# EAGLE design AutoIrrigator_Schematic (EAGLE 9.6.2)
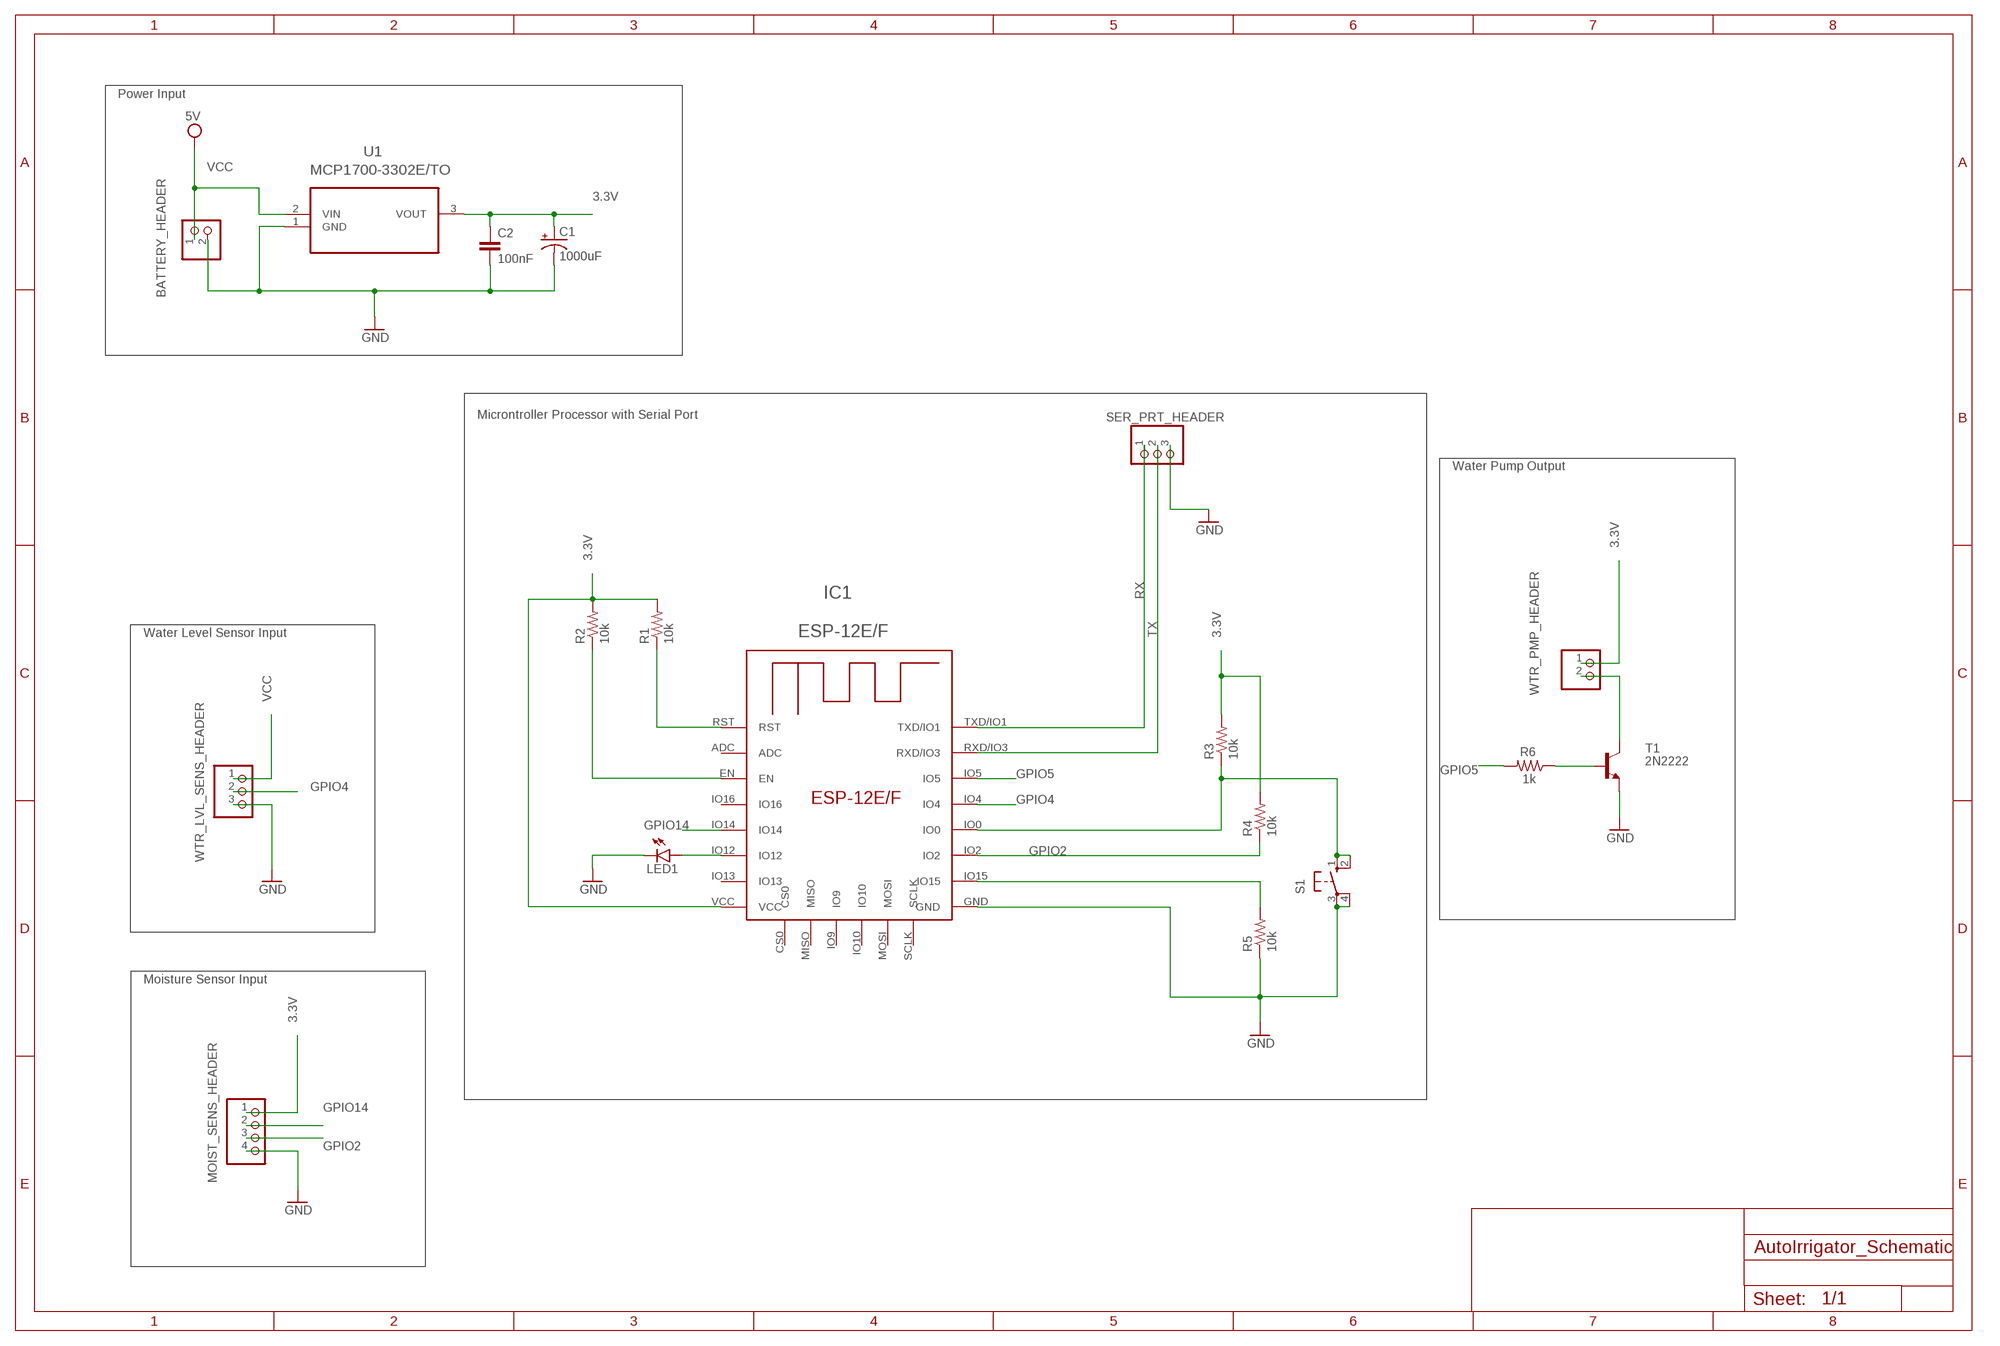
[diagram p0: schematic, sheet 1]

## Parts
BATTERY_HEADER  PINHD-1X2  [1X02]
C1  1000uF  CPOL-USE2.5-6  [E2,5-6]
C2  100nF  C-EU025-025X050  [C025-025X050]
IC1  ESP-12E/F  [ESP-12E]
LED1  LED5MM  [LED5MM]
MOIST_SENS_HEADER  PINHD-1X4  [1X04]
R1  10k  R-US_0204/7  [0204/7]
R2  10k  R-US_0204/7  [0204/7]
R3  10k  R-US_0204/7  [0204/7]
R4  10k  R-US_0204/7  [0204/7]
R5  10k  R-US_0204/7  [0204/7]
R6  1k  R-US_0204/7  [0204/7]
S1  10-XX  [B3F-10XX]
SER_PRT_HEADER  SER_PRT_HEADER  PINHD-1X3  [1X03]
T1  2N2222  [TO18]
U1  MCP1700-3302E/TO  [TO127P254X495-3]
WTR_LVL_SENS_HEADER  PINHD-1X3  [1X03]
WTR_PMP_HEADER  PINHD-1X2  [1X02]

## Nets
3.3V [Power]: C1.+ C2.1 IC1.VCC MOIST_SENS_HEADER.1 R1.2 R2.2 R3.2 R4.2 U1.3(VOUT) WTR_PMP_HEADER.1
COLLECTOR: T1.3(C) WTR_PMP_HEADER.2
EMITTER: R6.1 T1.2(B)
EN: IC1.EN R2.1
GND [Power]: BATTERY_HEADER.2 C1.- C2.2 IC1.GND LED1.K(C) MOIST_SENS_HEADER.4 R5.1 S1.3(P) S1.4(P1) SER_PRT_HEADER.3 T1.1(E) U1.1(GND) WTR_LVL_SENS_HEADER.3
GPIO0: IC1.IO0 R3.1 S1.1(S) S1.2(S1)
GPIO2: IC1.IO2 MOIST_SENS_HEADER.3 R4.1
GPIO4: IC1.IO4 WTR_LVL_SENS_HEADER.2
GPIO5: IC1.IO5 R6.2
GPIO12: IC1.IO12 LED1.A
GPIO14: IC1.IO14 MOIST_SENS_HEADER.2
GPIO15: IC1.IO15 R5.2
RST: IC1.RST R1.1
RX: IC1.TXD/IO1 SER_PRT_HEADER.1
TX: IC1.RXD/IO3 SER_PRT_HEADER.2
VCC [Power]: BATTERY_HEADER.1 U1.2(VIN) WTR_LVL_SENS_HEADER.1 ; supply symbol labelled 5V
Unconnected: IC1.ADC IC1.CS0 IC1.IO9 IC1.IO10 IC1.IO13 IC1.IO16 IC1.MISO IC1.MOSI IC1.SCLK

## Notes on the sheet
- Power Input
- Microntroller Processor with Serial Port
- Water Pump Output
- Water Level Sensor Input
- Moisture Sensor Input

## Library data of the parts
BATTERY_HEADER WTR_PMP_HEADER = pinhead:PINHD-1X2: PIN HEADER
C1 = rcl:CPOL-US: POLARIZED CAPACITOR, American symbol; SPICEPREFIX: C
C2 = rcl:C-EU: CAPACITOR, European symbol; SPICEPREFIX: C
IC1 = esp-12e-f:ESP-12E/F
LED1 = led:LED: LED OSRAM: - CHIPLED LG R971, LG N971, LY N971, LG Q971, LY Q971, LO R971, LY R971 LH N974, LH R974 LS Q976, LO Q976, LY Q976 LO Q996 - Hyper CHIPLED LW Q18S LB Q993, LB Q99A, LB R99A - SideLED LS A670, LO A670, LY A670, LG A670, LP A670 LB A673, LV A673, LT A673, LW A673 LH A674 LY A675 LS A676, LA A676, LO A676, LY A676, LW A676 LS A679, LY A679, LG A679 - Hyper Micro SIDELED® LS Y876, LA Y876, LO Y876, LY Y876 LT Y87S - SmartLED LW L88C, LW L88S LB L89C, LB L89S, LG L890 LS L89K, LO L89K, LY L89K LS L896, LA L896, LO L896, LY L896 - TOPLED LS T670, LO T670, LY T670, LG T670, LP T670 LSG T670, LSP T670, LSY T670, LOP T670, LYG T670 LG T671, LOG T671, LSG T671 LB T673, LV T673, LT T673, LW T673 LH T674 LS T676, LA T676, LO T676, LY T676, LB T676, LH T676, LSB T676, LW T676 LB T67C, LV T67C, LT T67C, LS T67K, LO T67K, LY T67K, LW E67C LS E67B, LA E67B, LO E67B, LY E67B, LB E67C, LV E67C, LT E67C LW T67C LS T679, LY T679, LG T679 LS T770, LO T770, LY T770, LG T770, LP T770 LB T773, LV T773, LT T773, LW T773 LH T774 LS E675, LA E675, LY E675, LS T675 LS T776, LA T776, LO T776, LY T776, LB T776 LHGB T686 LT T68C, LB T68C - Hyper Mini TOPLED® LB M676 - Mini TOPLED Santana® LG M470 LS M47K, LO M47K, LY M47K Source: http://www.osram.convergy.de LUXEON: - LUMILED® LXK2-PW12-R00, LXK2-PW12-S00, LXK2-PW14-U00, LXK2-PW14-V00 LXK2-PM12-R00, LXK2-PM12-S00, LXK2-PM14-U00 LXK2-PE12-Q00, LXK2-PE12-R00, LXK2-PE12-S00, LXK2-PE14-T00, LXK2-PE14-U00 LXK2-PB12-K00, LXK2-PB12-L00, LXK2-PB12-M00, LXK2-PB14-N00, LXK2-PB14-P00, LXK2-PB14-Q00 LXK2-PR12-L00, LXK2-PR12-M00, LXK2-PR14-Q00, LXK2-PR14-R00 LXK2-PD12-Q00, LXK2-PD12-R00, LXK2-PD12-S00 LXK2-PH12-R00, LXK2-PH12-S00 LXK2-PL12-P00, LXK2-PL12-Q00, LXK2-PL12-R00 Source: www.luxeon.com KINGBRIGHT: KA-3528ASYC Source: www.kingbright.com
MOIST_SENS_HEADER = pinhead:PINHD-1X4: PIN HEADER
R1-R6 = rcl:R-US_: RESISTOR, American symbol; SPICEPREFIX: R
S1 = switch-omron:10-XX: OMRON SWITCH; MPN: B3F-1000; OC_FARNELL: 176432; OC_NEWARK: 36M3542
SER_PRT_HEADER WTR_LVL_SENS_HEADER = pinhead:PINHD-1X3: PIN HEADER
T1 = transistor:2N2222: NPN TRANSISTOR
U1 = MCP1700-3302E_TO:MCP1700-3302E/TO: IC LDO REG 250MA 5.0V Check prices <https://pricing.snapeda.com/parts/MCP1700-3302E/TO/Microchip/view-part?ref=eda>; AVAILABILITY: Good; DESCRIPTION: Linear Voltage Regulator IC 1 Output 250mA TO-92-3; MF: Microchip; MP: MCP1700-3302E/TO; PACKAGE: TO-92 Microchip; PRICE: None; PURCHASE-URL: https://pricing.snapeda.com/search/part/MCP1700-3302E/TO/?ref=eda

## Net classes
0 default: width 0.254 mm, drill 0.152 mm, clearance 0.254 mm
1 Power: width 1.143 mm, drill 0.152 mm, clearance 0.254 mm

## Board
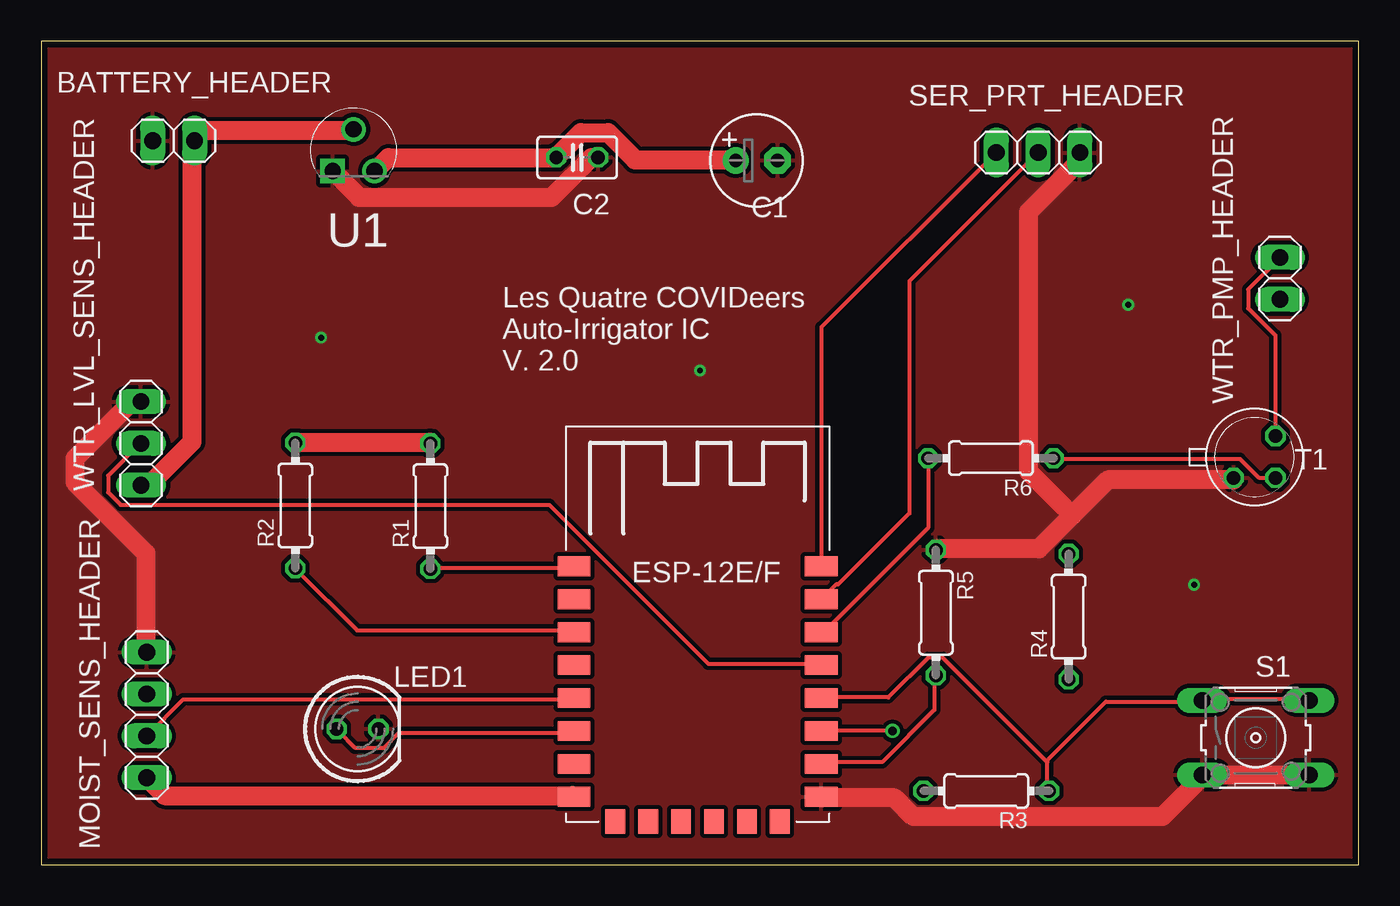
[diagram p1: board, top side]
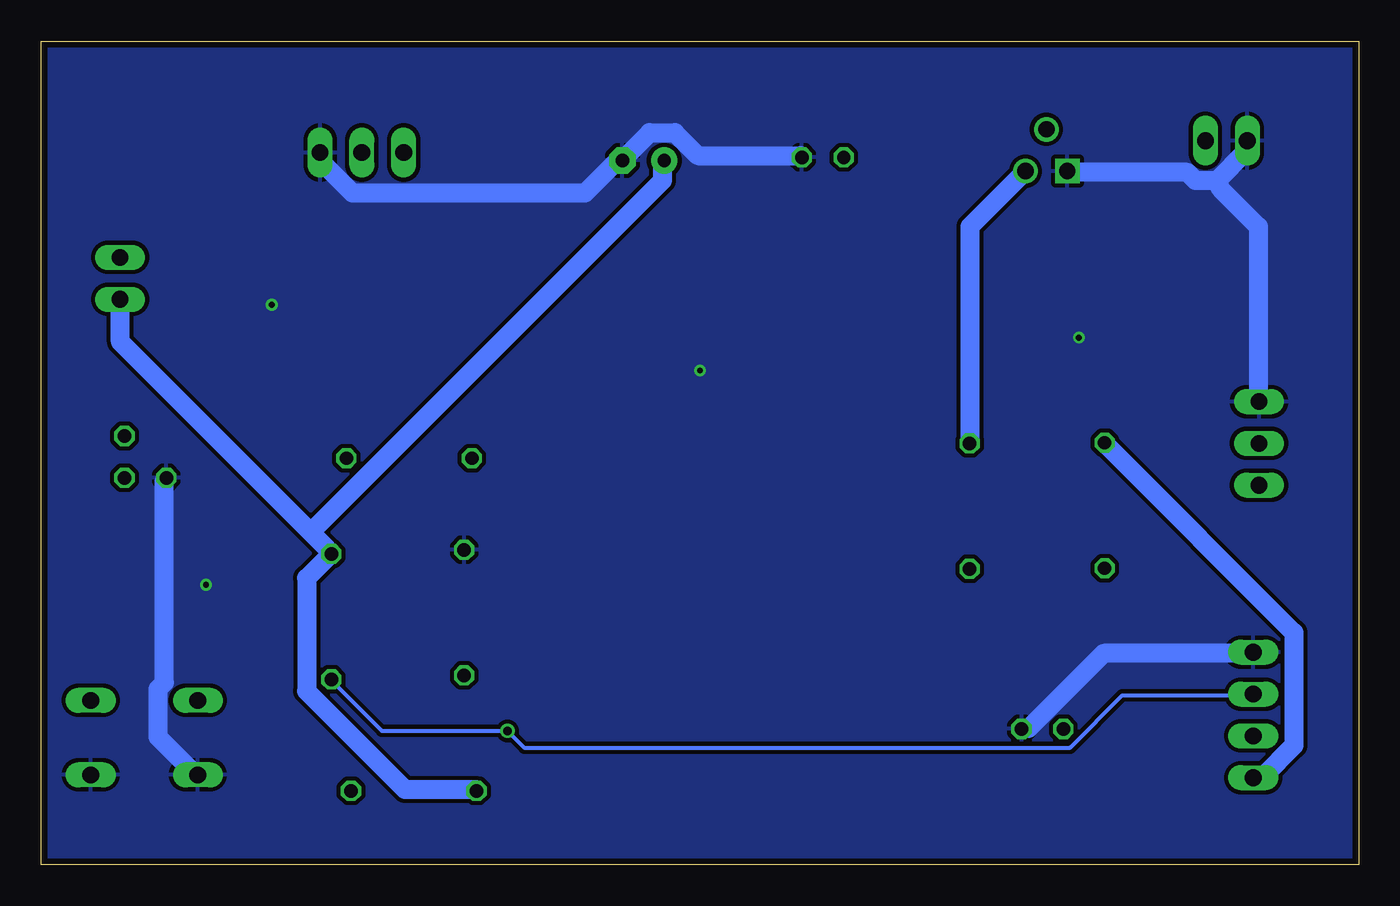
[diagram p2: board, bottom side, seen from below]

Size 80 x 50 mm. Coordinates in mm from the lower left corner, seen from the top.
Outline: 0,0 80,0 80,50 0,50 0,0
Copper layers (1*16): Top 0.0356mm / dielectric 1.5011mm / Bottom 0.0356mm
Design rules "LaenPCBOrder": minimum track width 6mil, minimum drill 13mil, track to track 6mil, track to pad 6mil, pad to pad 6mil, via to via 6mil, smd to smd 6mil, copper to edge 15mil, drill to drill 6mil, minimum pad ring 7mil, minimum via ring 7mil, stop-mask expansion 3mil, vias tented up to drill 0mil, thermal gap 10mil

### Footprints (pad centres in the part's own frame; a part is rotated, then mirrored left to right if it is on the bottom)
1X02 = drill 1.016 long: 1 -1.27,0; 2 1.27,0
E2,5-6 = drill 0.813 pad 1.6: + -1.27,0 | drill 0.813 pad 1.6 octagon: - 1.27,0
C025-025X050 = drill 0.813 octagon: 1 -1.27,0; 2 1.27,0
ESP-12E = smd 2 x 1.2: ADC -7.46,5.53; EN -7.46,3.53; GND 7.54,-6.47; IO0 7.54,-0.47; IO2 7.54,-2.47; IO4 7.54,1.53; IO5 7.54,3.53; IO12 -7.46,-2.47; IO13 -7.46,-4.47; IO14 -7.46,-0.47; IO15 7.54,-4.47; IO16 -7.46,1.53; RST -7.46,7.53; RXD/IO3 7.54,5.53; TXD/IO1 7.54,7.53; VCC -7.46,-6.47 | smd 1.2 x 1.5: CS0 -4.96,-7.97; IO9 -0.96,-7.97; IO10 1.04,-7.97; MISO -2.96,-7.97; MOSI 3.04,-7.97; SCLK 5.04,-7.97
LED5MM = drill 0.813 octagon: A -1.27,0; K 1.27,0
1X04 = drill 1.016 long: 1 -3.81,0; 2 -1.27,0; 3 1.27,0; 4 3.81,0
0204/7 = drill 0.813 octagon: 1 -3.81,0; 2 3.81,0
B3F-10XX = drill 1.016 long: 1 -3.251,2.261; 2 3.251,2.261; 3 -3.251,-2.261; 4 3.251,-2.261
1X03 = drill 1.016 long: 1 -2.54,0; 2 0,0; 3 2.54,0
TO18 = drill 0.813 octagon: 1 -1.27,-1.27; 2 1.27,-1.27; 3 1.27,1.27
TO127P254X495-3 = drill 0.991 square: 1 -2.54,-2.54 | drill 0.991: 2 -1.27,0; 3 0,-2.54

### Placement (x,y rotation side)
BATTERY_HEADER  8.04,43.96 180 top
C1  43.44,42.76 0 top
C2  32.54,42.94 0 top
IC1  39.81,10.59 0 top
LED1  19.21,8.24 0 top
MOIST_SENS_HEADER  6.41,9.09 90 top
R1  23.63,21.77 90 top
R2  15.43,21.81 90 top
R3  57.38,4.48 180 top
R4  62.38,15.06 90 top
R5  54.32,15.3 270 top
R6  57.66,24.68 180 top
S1  73.74,7.71 0 top
SER_PRT_HEADER  60.53,43.24 0 top
T1  73.67,24.76 0 top
U1  20.24,44.65 0 top
WTR_LVL_SENS_HEADER  6.06,25.58 90 top
WTR_PMP_HEADER  75.21,35.6 90 top

### Tracks (layer width: path | path; a pad name or v marks a point on that pad's centre or on a via)
3.3V
  Top 1.143: IC1.VCC 32.26,4.19 7.49,4.19 6.48,5.21 MOIST_SENS_HEADER.1 | R1.2 23.62,25.65 15.49,25.65 R2.2 | U1.3 20.32,42.16 21.08,42.93 31.24,42.93 C2.1 31.62,43.31 32.77,44.45 34.42,44.45 36.07,42.8 42.16,42.8 C1.+
  Bottom 1.143: R3.2 53.59,4.57 57.91,4.57 63.88,10.54 63.88,17.4 62.48,18.8 R4.2 62.74,19.3 63.63,20.19 | 63.63,20.19 75.18,31.75 75.18,34.29 WTR_PMP_HEADER.1 | R1.2 23.62,25.65 23.62,38.73 20.32,42.04 U1.3 | MOIST_SENS_HEADER.1 6.35,5.33 5.84,5.33 3.94,7.24 3.94,14.1 15.37,25.53 R2.2 | 63.63,20.19 42.29,41.53 42.29,42.67 C1.+
COLLECTOR
  Top 0.254: T1.3 74.93,32.13 73.28,33.78 73.28,34.92 75.18,36.83 WTR_PMP_HEADER.2
EMITTER
  Top 0.254: T1.2 73.91,23.5 72.77,24.64 61.59,24.64 R6.1
EN
  Top 0.254: IC1.EN 32.26,14.22 19.18,14.22 15.49,17.91 R2.1
GND  (via drill 0.35)
  Top 1.143: 62.61,21.21 64.77,23.37 72.39,23.37 T1.1 | 62.61,21.21 60.58,19.18 54.36,19.18 R5.1 | IC1.GND 47.37,4.06 51.82,4.06 52.96,2.92 68.07,2.92 70.48,5.33 S1.3 70.99,5.46 76.96,5.46 S1.4 | MOIST_SENS_HEADER.4 6.35,12.95 6.35,18.92 2.05,23.23 2.05,24.65 5.46,28.07 5.97,28.07 WTR_LVL_SENS_HEADER.3 | C2.2 33.78,42.93 33.4,42.93 30.99,40.51 19.3,40.51 17.78,42.04 U1.1 | 62.61,21.21 59.94,23.88 59.94,39.62 62.99,42.67 62.99,43.18 SER_PRT_HEADER.3
  Bottom 1.143: T1.1 72.52,23.37 72.52,11.05 72.9,10.67 72.9,7.75 70.61,5.46 S1.3 | C2.2 33.91,43.05 40.13,43.05 41.53,44.45 43.05,44.45 44.7,42.8 C1.- 45.21,42.55 46.99,40.77 61.09,40.77 62.99,42.67 62.99,43.18 SER_PRT_HEADER.3 | LED1.K 20.45,8.26 20.07,8.26 15.49,12.83 6.48,12.83 MOIST_SENS_HEADER.4 | 8.64,41.53 9.91,41.53 10.41,42.04 17.65,42.04 U1.1 | 8.64,41.53 6.86,43.31 6.86,43.94 BATTERY_HEADER.2 | WTR_LVL_SENS_HEADER.3 6.1,28.19 6.1,38.73 8.38,41.02 8.64,41.53
  other vias: 17,32 40,30 66,34 70,17
  pour Top: 0,0 0,50 80,50 80,0
  pour Bottom: 0,0 0,50 80,50 80,0
GPIO0
  Top 0.254: S1.2 76.96,10.03 70.61,10.03 S1.1 70.48,9.91 64.64,9.91 61.02,6.29 | 61.02,6.29 61.09,6.22 61.09,4.57 R3.1 | 61.02,6.29 54.74,12.57 53.85,12.57 51.44,10.16 47.37,10.16 IC1.IO0
GPIO2  (via drill 0.51)
  Top 0.254: v51.69,8.13 47.37,8.13 IC1.IO2
  Bottom 0.254: R4.1 62.36,11.18 59.31,8.13 v51.69,8.13 50.67,7.11 17.53,7.11 14.35,10.29 6.48,10.29 MOIST_SENS_HEADER.3
GPIO4
  Top 0.254: IC1.IO4 47.24,12.19 40.51,12.19 30.86,21.84 4.83,21.84 4.06,22.61 4.06,23.62 5.97,25.53 WTR_LVL_SENS_HEADER.2
GPIO5
  Top 0.254: IC1.IO5 47.37,14.22 47.62,14.22 53.85,20.45 53.85,24.64 R6.2
GPIO12
  Top 0.254: IC1.IO12 32.26,8 21.72,8 20.83,7.11 19.05,7.11 18.03,8.13 LED1.A
GPIO14
  Top 0.254: IC1.IO14 32.26,10.03 8.64,10.03 6.48,7.87 MOIST_SENS_HEADER.2
GPIO15
  Top 0.254: IC1.IO15 47.37,6.22 51.05,6.22 54.23,9.4 54.23,11.43 R5.2
RST
  Top 0.254: IC1.RST 32.26,18.03 23.75,18.03 R1.1
RX
  Top 0.254: IC1.TXD/IO1 47.37,18.16 47.37,32.64 57.91,43.18 SER_PRT_HEADER.1
TX
  Top 0.254: IC1.RXD/IO3 47.37,16.13 48.26,17.02 48.39,17.02 52.7,21.34 52.7,35.43 60.45,43.18 SER_PRT_HEADER.2
VCC
  Top 1.143: U1.2 18.92,44.58 9.91,44.58 9.4,44.07 BATTERY_HEADER.1 9.14,43.43 9.14,25.65 6.6,23.11 6.1,23.11 WTR_LVL_SENS_HEADER.1

### Text on the board
tPlace: Les Quatre COVIDeers / Auto-Irrigator IC / V. 2.0